# EAGLE design 20x20element (EAGLE 7.6.0)
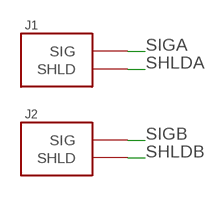
[diagram p0: schematic, sheet 1]

## Parts
J1  SMA-SMT-  [0732511352]
J2  SMA-SMT-  [0732511352]

## Nets
SHLDA: J1.SHLD1(SHLD) J1.SHLD2(SHLD) J1.SHLD3(SHLD) J1.SHLD4(SHLD)
SHLDB: J2.SHLD1(SHLD) J2.SHLD2(SHLD) J2.SHLD3(SHLD) J2.SHLD4(SHLD)
SIGA: J1.SIG
SIGB: J2.SIG

## Library data of the parts
J1 J2 = myLib:SMA; MFG: molex; MPN: 0732511352

## Board
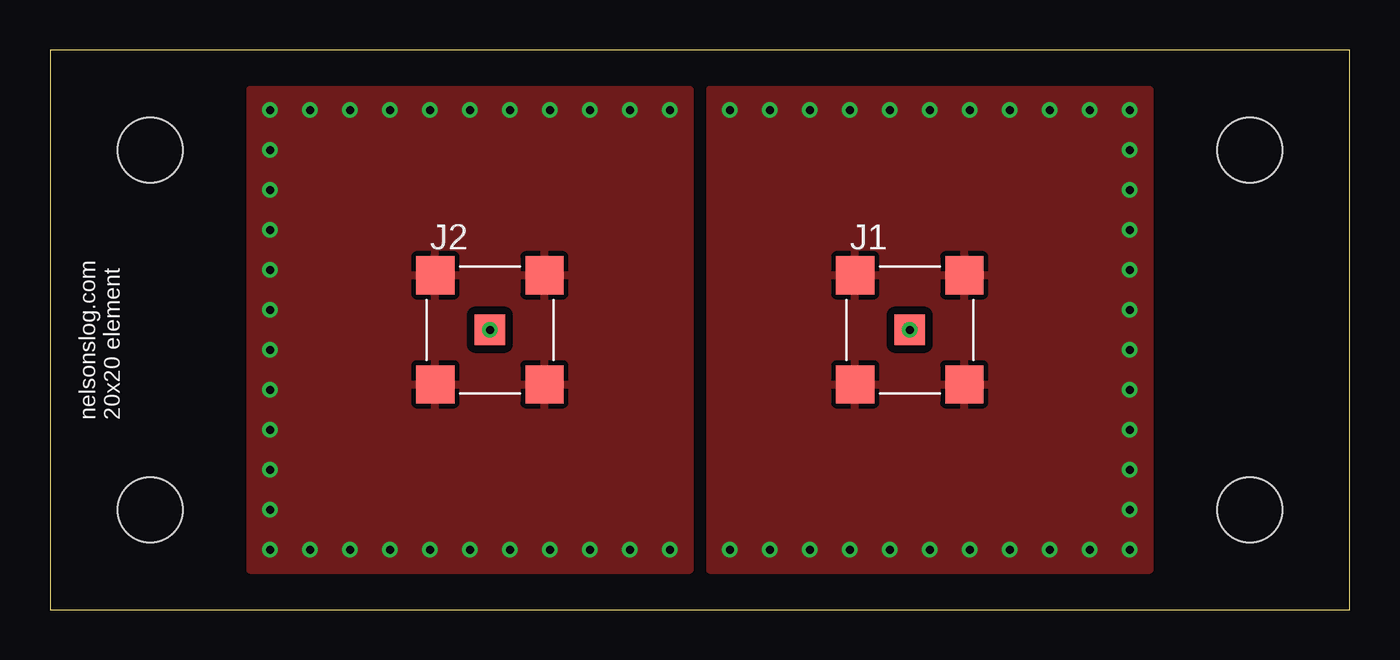
[diagram p1: board, top side]
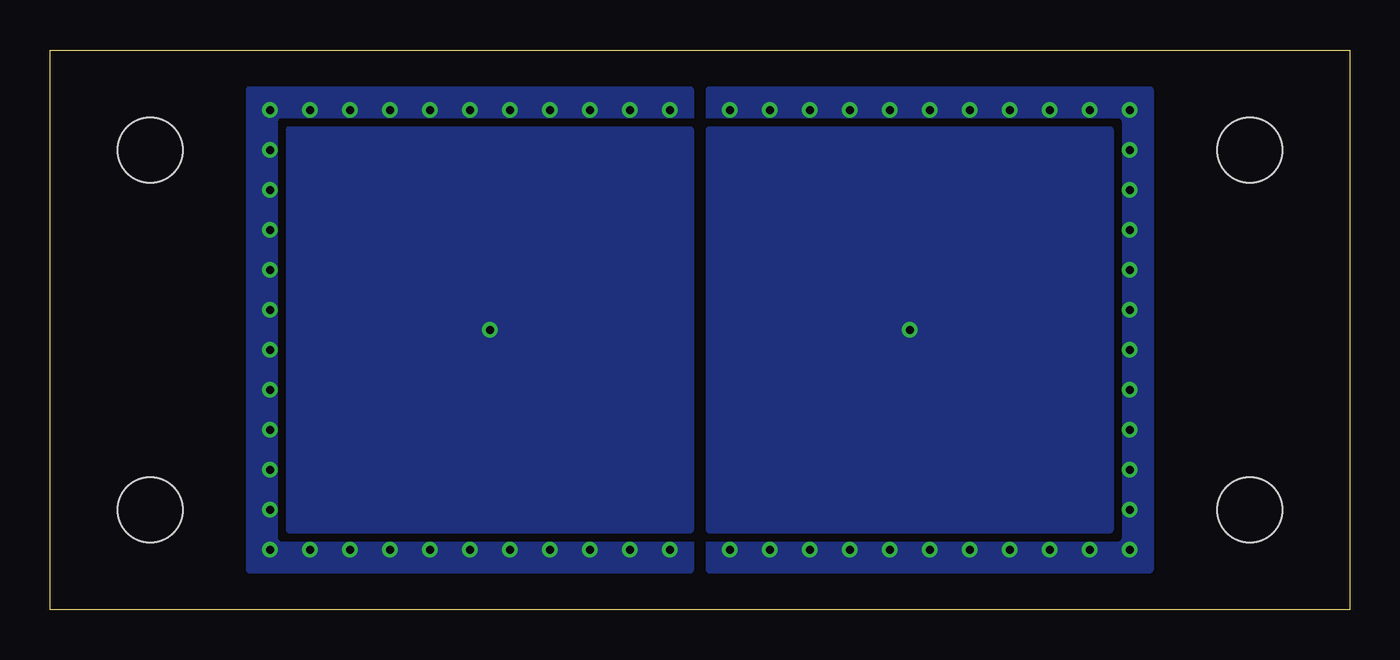
[diagram p2: board, bottom side, seen from below]

Size 65 x 28 mm. Coordinates in mm from the lower left corner, seen from the top.
Outline: 0,0 65,0 65,28 0,28 0,0
Copper layers (1*16): Top 0.0356mm / dielectric 1.5011mm / Bottom 0.0356mm
Design rules "oshpark-2layer *": minimum track width 6mil, minimum drill 13mil, track to track 6mil, track to pad 6mil, pad to pad 6mil, via to via 6mil, smd to smd 6mil, copper to edge 15mil, drill to drill 6mil, minimum pad ring 7mil, minimum via ring 7mil, stop-mask expansion 2.5mil, vias tented up to drill 14mil, thermal gap 10mil
Holes 3.25 mm at 5,23 5,5 60,23 60,5

### Footprints (pad centres in the part's own frame; a part is rotated, then mirrored left to right if it is on the bottom)
0732511352 = smd 1.91 x 1.91: SHLD1 -2.73,2.73; SHLD2 2.73,2.73; SHLD3 2.73,-2.73; SHLD4 -2.73,-2.73 | smd 1.52 x 1.52: SIG 0,0

### Placement (x,y rotation side)
J1  43,14 0 top
J2  22,14 0 top

### Tracks (layer width: path | path; a pad name or v marks a point on that pad's centre or on a via)
SHLDA  (via drill 0.4)
  other vias: 34,3 36,3 38,3 40,3 42,3 44,3 46,3 48,3 50,3 52,3 54,3 54,5 54,7 54,9 54,11 54,13 54,15 54,17 54,19 54,21 54,23 54,25 52,25 50,25 48,25 46,25 44,25 42,25 40,25 38,25 36,25 34,25
  pour Top (isolate 0.4, rank 2): 33,2 55,2 55,26 33,26
  pour Bottom (isolate 0.4, rank 2): 33,2 55,2 55,26 33,26
SHLDB  (via drill 0.4)
  other vias: 11,3 13,3 15,3 17,3 19,3 21,3 23,3 25,3 27,3 29,3 31,3 11,5 11,7 11,9 11,11 11,13 11,15 11,17 11,19 11,21 11,23 11,25 13,25 15,25 17,25 19,25 21,25 23,25 25,25 27,25 29,25 31,25
  pour Bottom (isolate 0.4, rank 2): 10,2 32,2 32,26 10,26
  pour Top (isolate 0.4, rank 2): 10,2 32,2 32,26 10,26
SIGA  (via drill 0.4)
  other vias: 43,14
  pour Bottom: 33,4 53,4 53,24 33,24
SIGB  (via drill 0.4)
  other vias: 22,14
  pour Bottom: 12,4 32,4 32,24 12,24

### Text on the board
tPlace: nelsonslog.com / 20x20 element